# Altium schematic sheet Xtal.SchDoc
size A
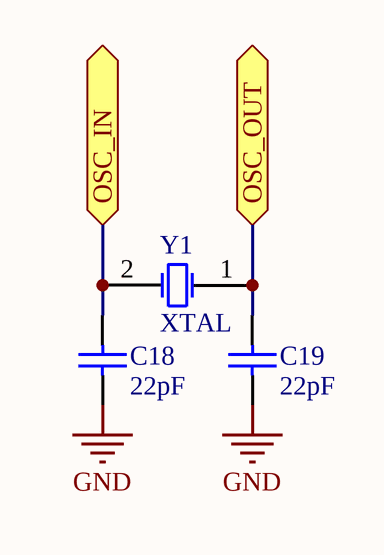
[diagram p0: Xtal.SchDoc]

## Parts
C18  value 22pF  [2012[0805]]  (hidden comment: Cap_UP)
C19  value 22pF  [2012[0805]]  (hidden comment: Cap_UP)
Y1  XTAL  [XTALL]

## Ports
OSC_IN, OSC_OUT

## Nets
GND: C18.2 C19.2
OSC_IN: C18.1 Y1.2(OSC2) ; port OSC_IN
OSC_OUT: C19.1 Y1.1(OSC1) ; port OSC_OUT

## Library data of the parts
C18 C19 = Cap_UP: Capacitor; Published: 8-Jun-2000; LatestRevisionDate: 17-Jul-2002; LatestRevisionNote: Re-released for DXP Platform.; PackageReference: RAD-0.3; Publisher: Altium Limited
Y1 = XTAL: Crystal Oscillator; Published: 8-Jun-2000; LatestRevisionDate: 17-Jul-2002; LatestRevisionNote: Re-released for DXP Platform.; PackageReference: R38; Publisher: Altium Limited